# Altium schematic sheet Directional_Coupler.SchDoc: Directional Coupler
size A4; Author: Almela; Revision: 1.2; SheetNumber: 6; SheetTotal: 7
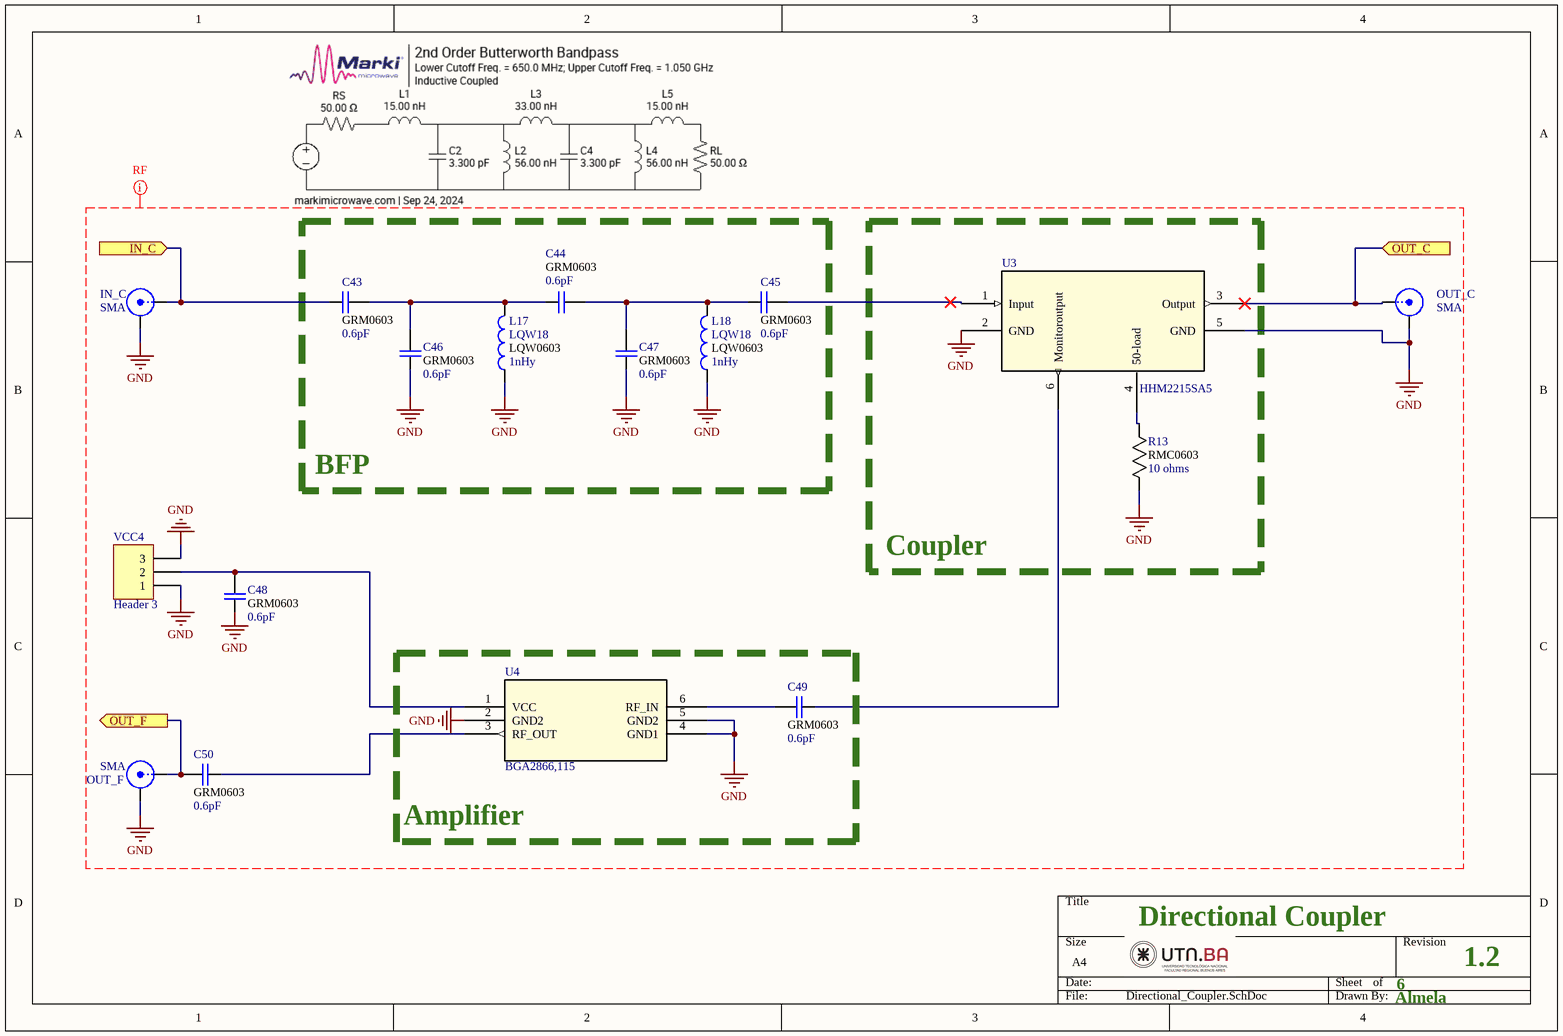
[diagram p0: Directional_Coupler.SchDoc]

## Parts
C43  value 0.6pF  footprint: GRM0603  [CAPC1608X90N]  (hidden comment: Cap 0603)
C44  value 0.6pF  footprint: GRM0603  [CAPC1608X90N]  (hidden comment: Cap 0603)
C45  value 0.6pF  footprint: GRM0603  [CAPC1608X90N]  (hidden comment: Cap 0603)
C46  value 0.6pF  footprint: GRM0603  [CAPC1608X90N]  (hidden comment: Cap 0603)
C47  value 0.6pF  footprint: GRM0603  [CAPC1608X90N]  (hidden comment: Cap 0603)
C48  value 0.6pF  footprint: GRM0603  [CAPC1608X90N]  (hidden comment: Cap 0603)
C49  value 0.6pF  footprint: GRM0603  [CAPC1608X90N]  (hidden comment: Cap 0603)
C50  value 0.6pF  footprint: GRM0603  [CAPC1608X90N]  (hidden comment: Cap 0603)
IN_C  SMA  [SMA-142-0701-851_V2]
L17  LQW18  value 1nHy  Parameter 1: LQW0603  [INDC1608X100N]
L18  LQW18  value 1nHy  Parameter 1: LQW0603  [INDC1608X100N]
OUT_C  SMA  [SMA-142-0701-851_V2]
OUT_F  SMA  [SMA-142-0701-851]
R13  value 10 ohms  footprint: RMC0603  [RESC1508X55N]  (hidden comment: Resistor)
U3  HHM2215SA5  [HHM-6_1P6X0P8]
U4  BGA2866,115  [SOT363_NXP]
VCC4  Header 3  [HDR1X3]

## Blocks framed on the sheet
BFP: C43-C47 L17 L18
Coupler: R13 U3
Amplifier: C49 U4

## Ports
IN_C (in), OUT_C (in), OUT_F (out)

## Nets
GND: C46.1 C47.1 C48.1 IN_C.2(Y) L17.1 L18.1 OUT_C.2(Y) OUT_F.2(Y) R13.1 U3.2(GND) U3.5(GND) U4.2(GND2) U4.4(GND1) U4.5(GND2) VCC4.1 VCC4.3
IN_C: C43.1 IN_C.1(X) ; port IN_C
OUT_C: OUT_C.1(X) U3.3(Output) ; port OUT_C
OUT_F: C50.2 OUT_F.1(X) ; port OUT_F
NetC43_2: C43.2 C44.1 C46.2 L17.2
NetC44_2: C44.2 C45.1 C47.2 L18.2
NetC45_2: C45.2 U3.1(Input)
NetC48_2: C48.2 U4.1(VCC) VCC4.2
NetC49_1: C49.1 U3.6(Monitoroutput)
NetC49_2: C49.2 U4.6(RF_IN)
NetC50_1: C50.1 U4.3(RF_OUT)
NetR13_2: R13.2 U3.4(50-load)

## Layout directives
net class RF50R: GND

## Library data of the parts
C43-C50 = Cap: Capacitor GRM18 0603; Published: 8-Jun-2000; LatestRevisionDate: 17-Jul-2002; LatestRevisionNote: Re-released for DXP Platform.; PackageReference: POLAR0.8; Publisher: Altium Limited; PackageDescription: Polarized Capacitor; 2 Leads; Supplier 1: Mouser
IN_C OUT_C = SMA: SMA Straight Connector; LatestRevisionDate: 17-Jul-2002; LatestRevisionNote: Re-released for DXP Platform.; Publisher: Altium Limited
L17 L18 = LQW18: Ind RF Chip Wirewound 18nH 5% 100MHz 40Q-Factor 550mA 0603 Paper T/R; MP: LQW18AN18NJ00D; Package: None; Price: None; Availability: Unavailable
OUT_F = SMB: SMB Straight Connector; LatestRevisionDate: 17-Jul-2002; LatestRevisionNote: Re-released for DXP Platform.; Publisher: Altium Limited
R13 = Resistor: Resistor RMC0603; Mfr_Name: Stackpole International
U3 = HHM2215SA5: No Description Available; Mfr_Name: TDK; RefDes: RefDes; Type: Type
U4 = BGA2866,115: No Description Available; Mfr_Name: NXP; RefDes: RefDes; Type: Type
VCC4 = Header 3: Header, 3-Pin; LatestRevisionDate: 17-Jul-2002; LatestRevisionNote: Re-released for DXP Platform.; Publisher: Altium Limited